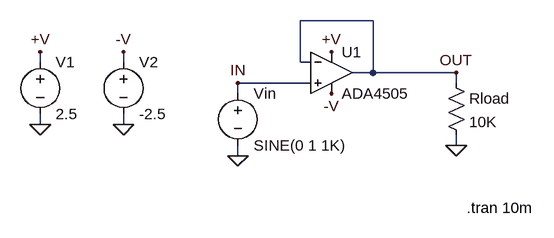
[diagram p0: schematic ADA4505.asc]
ADA4505.asc, the LTspice schematic file:
Version 4
SHEET 1 1240 700
WIRE 640 -1184 528 -1184
WIRE 128 -1120 128 -1136
WIRE 256 -1120 256 -1136
WIRE 528 -1120 528 -1184
WIRE 544 -1120 528 -1120
WIRE 640 -1104 640 -1184
WIRE 640 -1104 608 -1104
WIRE 768 -1104 640 -1104
WIRE 544 -1088 432 -1088
WIRE 768 -1088 768 -1104
WIRE 432 -1072 432 -1088
WIRE 128 -1024 128 -1040
WIRE 256 -1024 256 -1040
WIRE 768 -992 768 -1008
WIRE 432 -976 432 -992
FLAG 128 -1136 +V
FLAG 128 -1024 0
FLAG 432 -976 0
FLAG 768 -1104 OUT
FLAG 432 -1088 IN
FLAG 576 -1136 +V
FLAG 256 -1136 -V
FLAG 576 -1072 -V
FLAG 768 -992 0
FLAG 256 -1024 0
SYMBOL voltage 128 -1136 R0
WINDOW 123 0 0 Left 2
WINDOW 39 0 0 Left 2
SYMATTR InstName V1
SYMATTR Value 2.5
SYMBOL voltage 432 -1088 R0
WINDOW 123 24 146 Left 2
WINDOW 39 24 125 Left 2
SYMATTR InstName Vin
SYMATTR Value SINE(0 1 1K)
SYMBOL Opamps\\ADA4505 576 -1168 R0
SYMATTR InstName U1
SYMBOL voltage 256 -1136 R0
WINDOW 123 24 146 Left 2
WINDOW 39 24 125 Left 2
SYMATTR InstName V2
SYMATTR Value -2.5
SYMBOL res 752 -1104 R0
SYMATTR InstName Rload
SYMATTR Value 10K
TEXT 784 -896 Left 2 !.tran 10m

The netlist it stands for:
* ADA4505.asc
V1 +V 0 2.5
Vin IN 0 SINE(0 1 1K)
XU1 IN OUT +V -V OUT ADA4505  ; pins In+ In- V+ V- OUT
V2 -V 0 -2.5
Rload OUT 0 10K
.tran 10m
.backanno
.end